# EAGLE design Led_Flip_Flop (EAGLE 8.6.1)
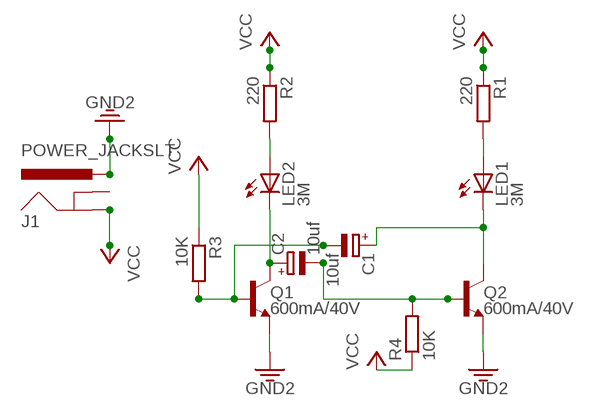
[diagram p0: schematic, sheet 1]

## Parts
C1  10uf  CPOL-EUE1.8-4  [E1,8-4]
C2  10uf  CPOL-EUE1.8-4  [E1,8-4]
J1  POWER_JACKSLT  [POWER_JACK_SLOT]
LED1  3M  LED5MM  [LED5MM]
LED2  3M  LED5MM  [LED5MM]
Q1  600mA/40V  TRANS_NPN-P2N2222A  [TO-92]
Q2  600mA/40V  TRANS_NPN-P2N2222A  [TO-92]
R1  220  R-EU_0207/10  [0207/10]
R2  220  R-EU_0207/10  [0207/10]
R3  10K  R-EU_0207/10  [0207/10]
R4  10K  R-EU_0207/10  [0207/10]

## Nets
3.3V: J1.PWR Q1.3(E) Q2.3(E) ; supply symbol labelled GND2
N$1: LED2.A R2.2
N$2: LED1.A R1.2
N$3: C2.+ LED2.K(C) Q1.1(C)
N$5: C1.- Q1.2(B) R3.2
N$6: C2.- Q2.2(B) R4.2
N$10: C1.+ LED1.K(C) Q2.1(C)
VCC: J1.GND@2(GND) R1.1 R2.1 R3.1 R4.1
Unconnected: J1.GND@1(GNDBREAK)

## Library data of the parts
C1 C2 = rcl:CPOL-EU: POLARIZED CAPACITOR, European symbol
J1 = SparkFun-Connectors:POWER_JACK: Power Jack Connector This is the standard 5.5mm barrel jack for power. The PTH is the most common, proven, reliable, footprint. The Slot footprint only works if the mill layer is transmitted to the PCB fab house so be warned. Here are the connectors we sell at SparkFun: DC Barrel Power Jack/Connector <https://www.sparkfun.com/products/119> (PRT-00119) DC Barrel Power Jack/Connector (SMD) <https://www.sparkfun.com/products/12748> (PRT-12748) DC Barrel Jack Adapter - Breadboard Compatible <https://www.sparkfun.com/products/10811> (PRT-10811) It is used on this SparkFun product (and many, many others): SparkFun RedBoard - Programmed with Arduino <https://www.sparkfun.com/products/12757> (DEV-12757) Also, if you need a mating power supply or connector, please check these out: Wall Adapter Power Supply - 9VDC 650mA <https://www.sparkfun.com/products/298> (TOL-00298) DC Barrel Jack Adapter - Male <https://www.sparkfun.com/products/10287> (PRT-10287); PROD_ID: PRT-00119
LED1 LED2 = led:LED: LED OSRAM: - CHIPLED LG R971, LG N971, LY N971, LG Q971, LY Q971, LO R971, LY R971 LH N974, LH R974 LS Q976, LO Q976, LY Q976 LO Q996 - Hyper CHIPLED LW Q18S LB Q993, LB Q99A, LB R99A - SideLED LS A670, LO A670, LY A670, LG A670, LP A670 LB A673, LV A673, LT A673, LW A673 LH A674 LY A675 LS A676, LA A676, LO A676, LY A676, LW A676 LS A679, LY A679, LG A679 - Hyper Micro SIDELED® LS Y876, LA Y876, LO Y876, LY Y876 LT Y87S - SmartLED LW L88C, LW L88S LB L89C, LB L89S, LG L890 LS L89K, LO L89K, LY L89K LS L896, LA L896, LO L896, LY L896 - TOPLED LS T670, LO T670, LY T670, LG T670, LP T670 LSG T670, LSP T670, LSY T670, LOP T670, LYG T670 LG T671, LOG T671, LSG T671 LB T673, LV T673, LT T673, LW T673 LH T674 LS T676, LA T676, LO T676, LY T676, LB T676, LH T676, LSB T676, LW T676 LB T67C, LV T67C, LT T67C, LS T67K, LO T67K, LY T67K, LW E67C LS E67B, LA E67B, LO E67B, LY E67B, LB E67C, LV E67C, LT E67C LW T67C LS T679, LY T679, LG T679 LS T770, LO T770, LY T770, LG T770, LP T770 LB T773, LV T773, LT T773, LW T773 LH T774 LS E675, LA E675, LY E675, LS T675 LS T776, LA T776, LO T776, LY T776, LB T776 LHGB T686 LT T68C, LB T68C - Hyper Mini TOPLED® LB M676 - Mini TOPLED Santana® LG M470 LS M47K, LO M47K, LY M47K Source: http://www.osram.convergy.de LUXEON: - LUMILED® LXK2-PW12-R00, LXK2-PW12-S00, LXK2-PW14-U00, LXK2-PW14-V00 LXK2-PM12-R00, LXK2-PM12-S00, LXK2-PM14-U00 LXK2-PE12-Q00, LXK2-PE12-R00, LXK2-PE12-S00, LXK2-PE14-T00, LXK2-PE14-U00 LXK2-PB12-K00, LXK2-PB12-L00, LXK2-PB12-M00, LXK2-PB14-N00, LXK2-PB14-P00, LXK2-PB14-Q00 LXK2-PR12-L00, LXK2-PR12-M00, LXK2-PR14-Q00, LXK2-PR14-R00 LXK2-PD12-Q00, LXK2-PD12-R00, LXK2-PD12-S00 LXK2-PH12-R00, LXK2-PH12-S00 LXK2-PL12-P00, LXK2-PL12-Q00, LXK2-PL12-R00 Source: www.luxeon.com KINGBRIGHT: KA-3528ASYC Source: www.kingbright.com
Q1 Q2 = SparkFun-DiscreteSemi:TRANS_NPN: NPN transistor Current controlled devices typically used to amplify current or used as a switch. BC547 - COM-08928 <http://www.sparkfun.com/products/8928> (TO-92 45V 100mA) (1.Collector 2.Base 3.Emitter) 2N3904 - COM-00521 <http://www.sparkfun.com/products/521> (TO-92 40V 200mA) (1.Emitter 2.Base 3.Collector) P2N2222A - COM-12852 <http://www.sparkfun.com/products/12852> (TO-92 40V 600mA) (1.Collector 2.Base 3.Emitter); PROD_ID: TRANS-09536
R1-R4 = rcl:R-EU_: RESISTOR, European symbol

## Board
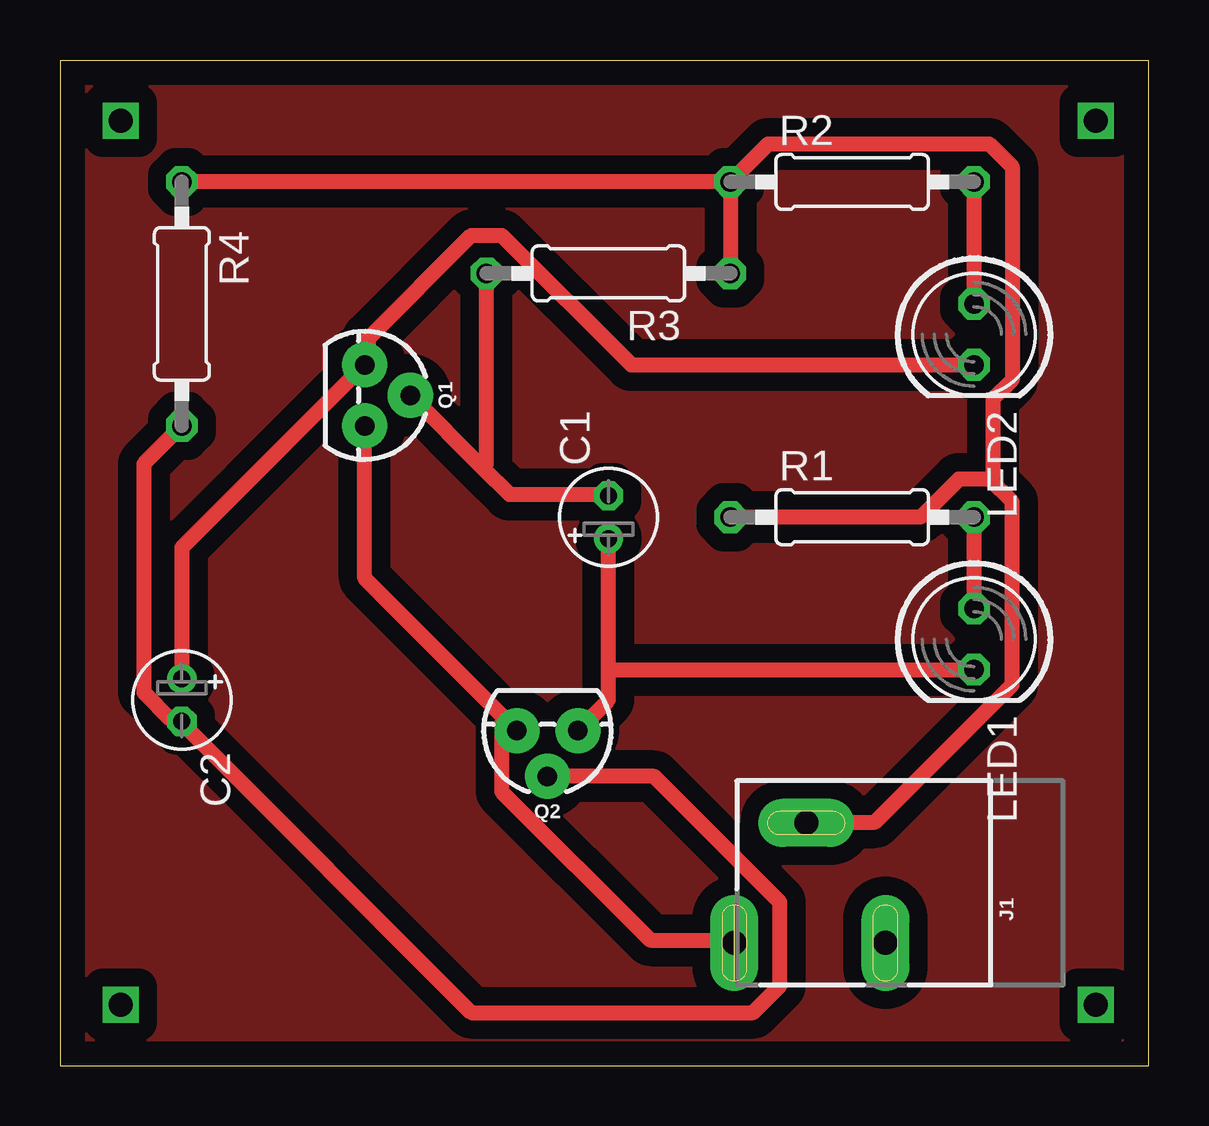
[diagram p1: board, top side]

Size 45.39 x 41.91 mm. Coordinates in mm from the lower left corner, seen from the top.
Outline: 45.39,41.9 45.39,0 0,0 0,41.9
Outline: 0,41.91 45.39,41.91
Copper layers (1*16): Top 0.035mm / dielectric 1.5mm / Bottom 0.035mm
Design rules "default *": minimum track width 25mil, minimum drill 0.35mm, track to track 30mil, track to pad 20mil, pad to pad 6mil, via to via 6mil, smd to smd 6mil, copper to edge 40mil, drill to drill 6mil, minimum pad ring 10mil, minimum via ring 8mil, stop-mask expansion 4mil, vias tented up to drill 0mil, thermal gap 10mil

### Footprints (pad centres in the part's own frame; a part is rotated, then mirrored left to right if it is on the bottom)
E1,8-4 = drill 0.711 pad 1.168: + -0.889,0 | drill 0.711 pad 1.168 octagon: - 0.889,0
POWER_JACK_SLOT = drill 1 pad 2 long: GND@1 2.58,7.5; GND@2 7.58,10.8; PWR 2.58,13.8
LED5MM = drill 0.813 octagon: A -1.27,0; K 1.27,0
TO-92 = drill 0.813 pad 1.88: 1 -1.27,0; 2 0,1.905; 3 1.27,0
0207/10 = drill 0.813 octagon: 1 -5.08,0; 2 5.08,0

### Placement (x,y rotation side)
C1  22.86,22.86 90 top
C2  5.08,15.24 270 top
J1  41.91,2.54 90 top
LED1  38.1,17.78 270 top
LED2  38.1,30.48 270 top
Q1  12.7,27.94 270 top
Q2  20.32,13.97 180 top
R1  33.02,22.86 0 top
R2  33.02,36.83 0 top
R3  22.86,33.02 180 top
R4  5.08,31.75 270 top

### Tracks (layer width: path | path; a pad name or v marks a point on that pad's centre or on a via)
3.3V
  Top 0.635: Q1.3 12.7,20.32 Q2.3 18.41,14.29 18.41,11.43 24.61,5.24 28.1,5.24 J1.PWR
GND2
  pour Top: 0,41.91 0,0 1.27,0 45.72,0 45.72,41.91
N$1
  Top 0.635: R2.2 LED2.A
N$2
  Top 0.635: R1.2 LED1.A
N$3
  Top 0.635: C2.+ 5.08,21.59 Q1.1 12.86,29.37 12.86,30.32 17.14,34.61 18.41,34.61 23.81,29.21 LED2.K
N$4  (via drill 1 pad 1.3)
  other vias: 2.54,39.37
N$5
  Top 0.635: Q1.2 17.62,24.92 | 17.62,24.92 18.73,23.81 22.86,23.81 C1.- | R3.2 17.78,25.08 17.62,24.92
N$6
  Top 0.635: R4.2 3.49,25.08 3.49,15.56 4.6,14.45 5.08,14.45 C2.- 5.24,14.13 17.14,2.22 28.89,2.22 30,3.33 30,6.83 24.77,12.06 Q2.2
N$7  (via drill 1 pad 1.3)
  other vias: 43.18,39.37
N$8  (via drill 1 pad 1.3)
  other vias: 2.54,2.54
N$9  (via drill 1 pad 1.3)
  other vias: 43.18,2.54
N$10
  Top 0.635: 22.86,16.51 22.86,15.24 Q2.1 | 22.86,16.51 C1.+ | 22.86,16.51 LED1.K
VCC
  Top 0.635: R1.1 35.88,22.86 37.47,24.45 38.73,24.45 | 38.73,24.45 39.69,23.49 39.69,15.88 33.97,10.16 31.11,10.16 J1.GND@2 | R2.1 R4.1 | R2.1 R3.1 | R2.1 29.53,38.42 38.73,38.42 39.69,37.46 39.69,28.57 38.89,27.78 38.89,24.61 38.73,24.45